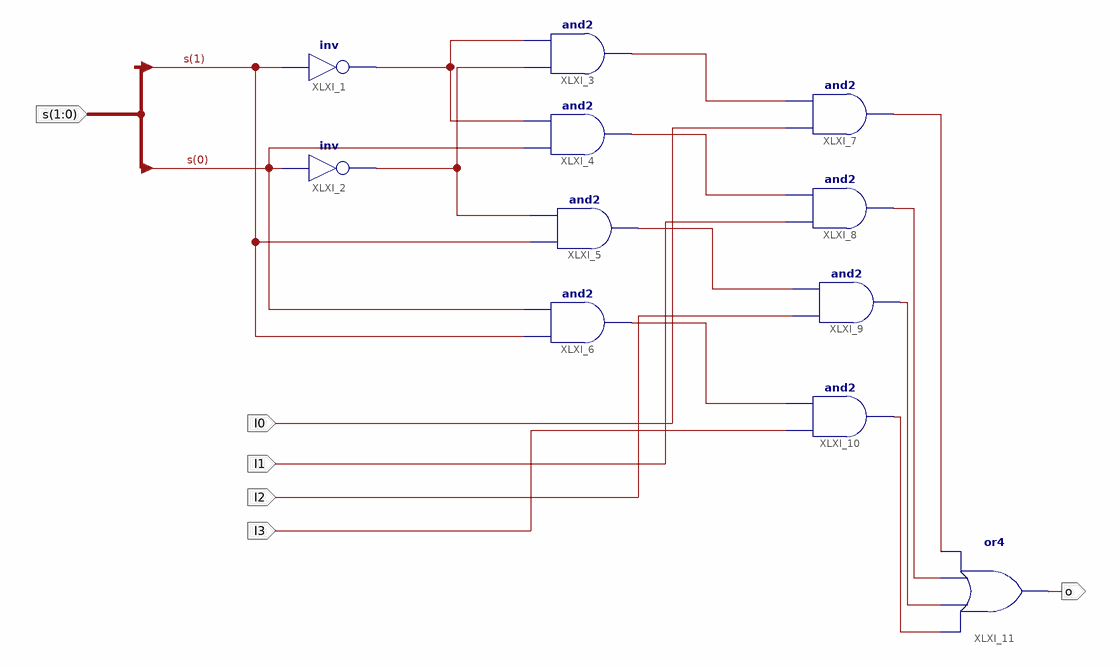
[diagram p0: schematic sheet 1]
// Xilinx ISE schematic MUX4to1.sch (kintex7) as structural Verilog: 11 symbols, 6 ports
module MUX4to1 (
  input  I0,
  input  I1,
  input  I2,
  input  I3,
  input  [1:0] s,
  output o
);

  wire XLXN_1, XLXN_3, XLXN_11, XLXN_12, XLXN_13, XLXN_14, XLXN_19, XLXN_20, XLXN_21, XLXN_22;

  not XLXI_1 (XLXN_1, s[1]);
  not XLXI_2 (XLXN_3, s[0]);
  and XLXI_3 (XLXN_11, XLXN_3, XLXN_1);
  and XLXI_4 (XLXN_12, s[0], XLXN_1);
  and XLXI_5 (XLXN_13, s[1], XLXN_3);
  and XLXI_6 (XLXN_14, s[1], s[0]);
  and XLXI_7 (XLXN_19, I0, XLXN_11);
  and XLXI_8 (XLXN_20, I1, XLXN_12);
  and XLXI_9 (XLXN_21, I2, XLXN_13);
  and XLXI_10 (XLXN_22, I3, XLXN_14);
  or XLXI_11 (o, XLXN_22, XLXN_21, XLXN_20, XLXN_19);
endmodule
